# Altium schematic sheet Detect220V.SchDoc
size A4; SheetNumber: 9; SheetTotal: 9
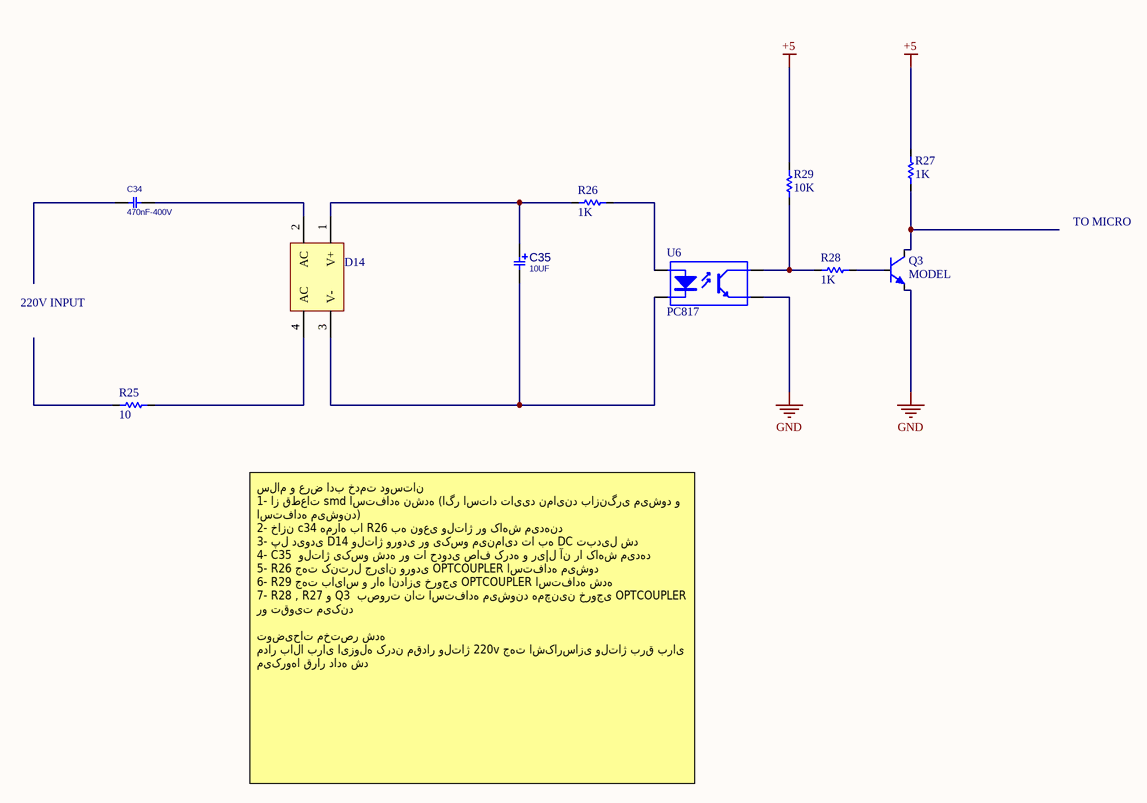
[diagram p0: Detect220V.SchDoc]

## Parts
C34  470nF-400V  [C_PLY_6X2_5]
C35  10UF  [C_EL_4X7]
D14  DF04S  [DF005S]  (value not drawn)
Q3  MODEL  [TO-92]
R25  10  [Res-(1/4)]
R26  1K  [Res-(1/4)]
R27  1K  [Res-(1/4)]
R28  1K  [Res-(1/4)]
R29  10K  [Res-(1/4)]
U6  PC817  [DIP4]

## Nets
+5: R27.2 R29.2
GND: Q3.1(E) U6.3(E)
NetC34_2: C34.2 D14.2(AC)
NetC35_1: C35.1 D14.1(V+) R26.1
NetC35_2: C35.2 D14.3(V-) U6.2(K)
NetD14_4: D14.4(AC) R25.2
NetQ3_2: Q3.2(B) R28.2
NetQ3_3: Q3.3(C) R27.1
NetR26_2: R26.2 U6.1(A)
NetR28_1: R28.1 R29.1 U6.4(C)

Not connected (* = marked no-connect by the designer): C34 1; R25 1

## Notes on the sheet
- TO MICRO
- 220V INPUT
- سلام و عرض ادب خدمت دوستان
  1- از قطعات smd استفاده نشده (اگر استاد تایید نمایند بازنگری میشود و استفاده میشوند)
  2- خازن c34 همراه با R26 به نوعی ولتاژ رو کاهش میدهند
  3- پل دیودی D14 ولتاژ ورودی رو یکسو مینماید تا به DC تبدیل شد
  4- C35  ولتاژ یکسو شده رو تا حدودی صاف کرده و ری|ل آن را کاهش میدهد
  5- R26 جهت کنترل جریان ورودی OPTCOUPLER استفاده میشود
  6- R29 جهت بایاس و راه اندازی خروجی OPTCOUPLER استفاده شده
  7- R28 , R27 و Q3  بصورت نات استفاده میشوند همچنین خروجی OPTCOUPLER رو تقویت میکند
  توضیحات مختصر شده
  مدار بالا برای ایزوله کردن مقدار ولتاژ 220v جهت اشکارسازی ولتاژ برق برای میکروها قرار داده شد

## Library data of the parts
C34 = CAP_THD_FILM_POLYESTER: CAP, FILM,; PARAM: 400V; MANF_P#: MANF_PART#; PRICE: 100= 1$; DESC: CAP, FILM,; MANF: MANF; PARAM2: PARAM2; ASSEMBLY: ASSEMBLY; VALUE: 470nF-400V
C35 = CAP_THD_EL: CAP, THD, ELEC,; MANF_P#: MANF_PART#; PARAM2: 20%; DESC: DESCRIPTION; DIST#: MOUSER; PARAM: 25V; PRICE: 10= 5$; MANF: MANF; ASSEMBLY: ASSEMBLY; VALUE: 10UF
D14 = DF04S: Diode BRIDGE RECTIFIER DF04S 1A; Part. No: DF04S-E3/77; Manufacturer: VISHAY; Manufacturer: FAIRCHILD SEMICONDUCTOR; Designer: Abbas Basereh; Link: http://www.tme.eu/en/details/df04s/smdtht-sing-phase-diode-bridge-rectif/fairchild-semiconductor/; Part. No: DF04S; Link: http://www.tme.eu/en/details/df04s-e3_77/smdtht-sing-phase-diode-bridge-rectif/vishay/; Link: http://www.digikey.com/product-detail/en/on-semiconductor-fairchild/DF04S/DF04SCT-ND/965570; Link: https://www.aliexpress.com/item/Free-shipping-DF04S-patch-legs-bridge-heap/32755062603.html?spm=2114.01010208.3.1.6XWzbc&ws_ab_test=searchweb0_0,searchweb201602_4_10065_10068_10084_10083_10080_10082_10081_10060_10061_10062_10056_10055_10054_10059_10099_10078_10079_427_10073_10103_10102_10096_10052_10050_10051,searchweb201603_4&btsid=2d7d6842-ff97-4af8-87da-adbb517ef3ca; Data: 16-12-2016
Q3 = S8050: NPN Bipolar Transistor
R25-R29 = Resistor: Tolerance: 5%; Power: 1/4 W
  R25: Value: 10
  R26-R28: Value: 1K
  R29: Value: 10K
U6 = OPTCOUPLER_01: 4-Pin Phototransistor Optocoupler